# EAGLE design Schematic_v2 (EAGLE 5.10)
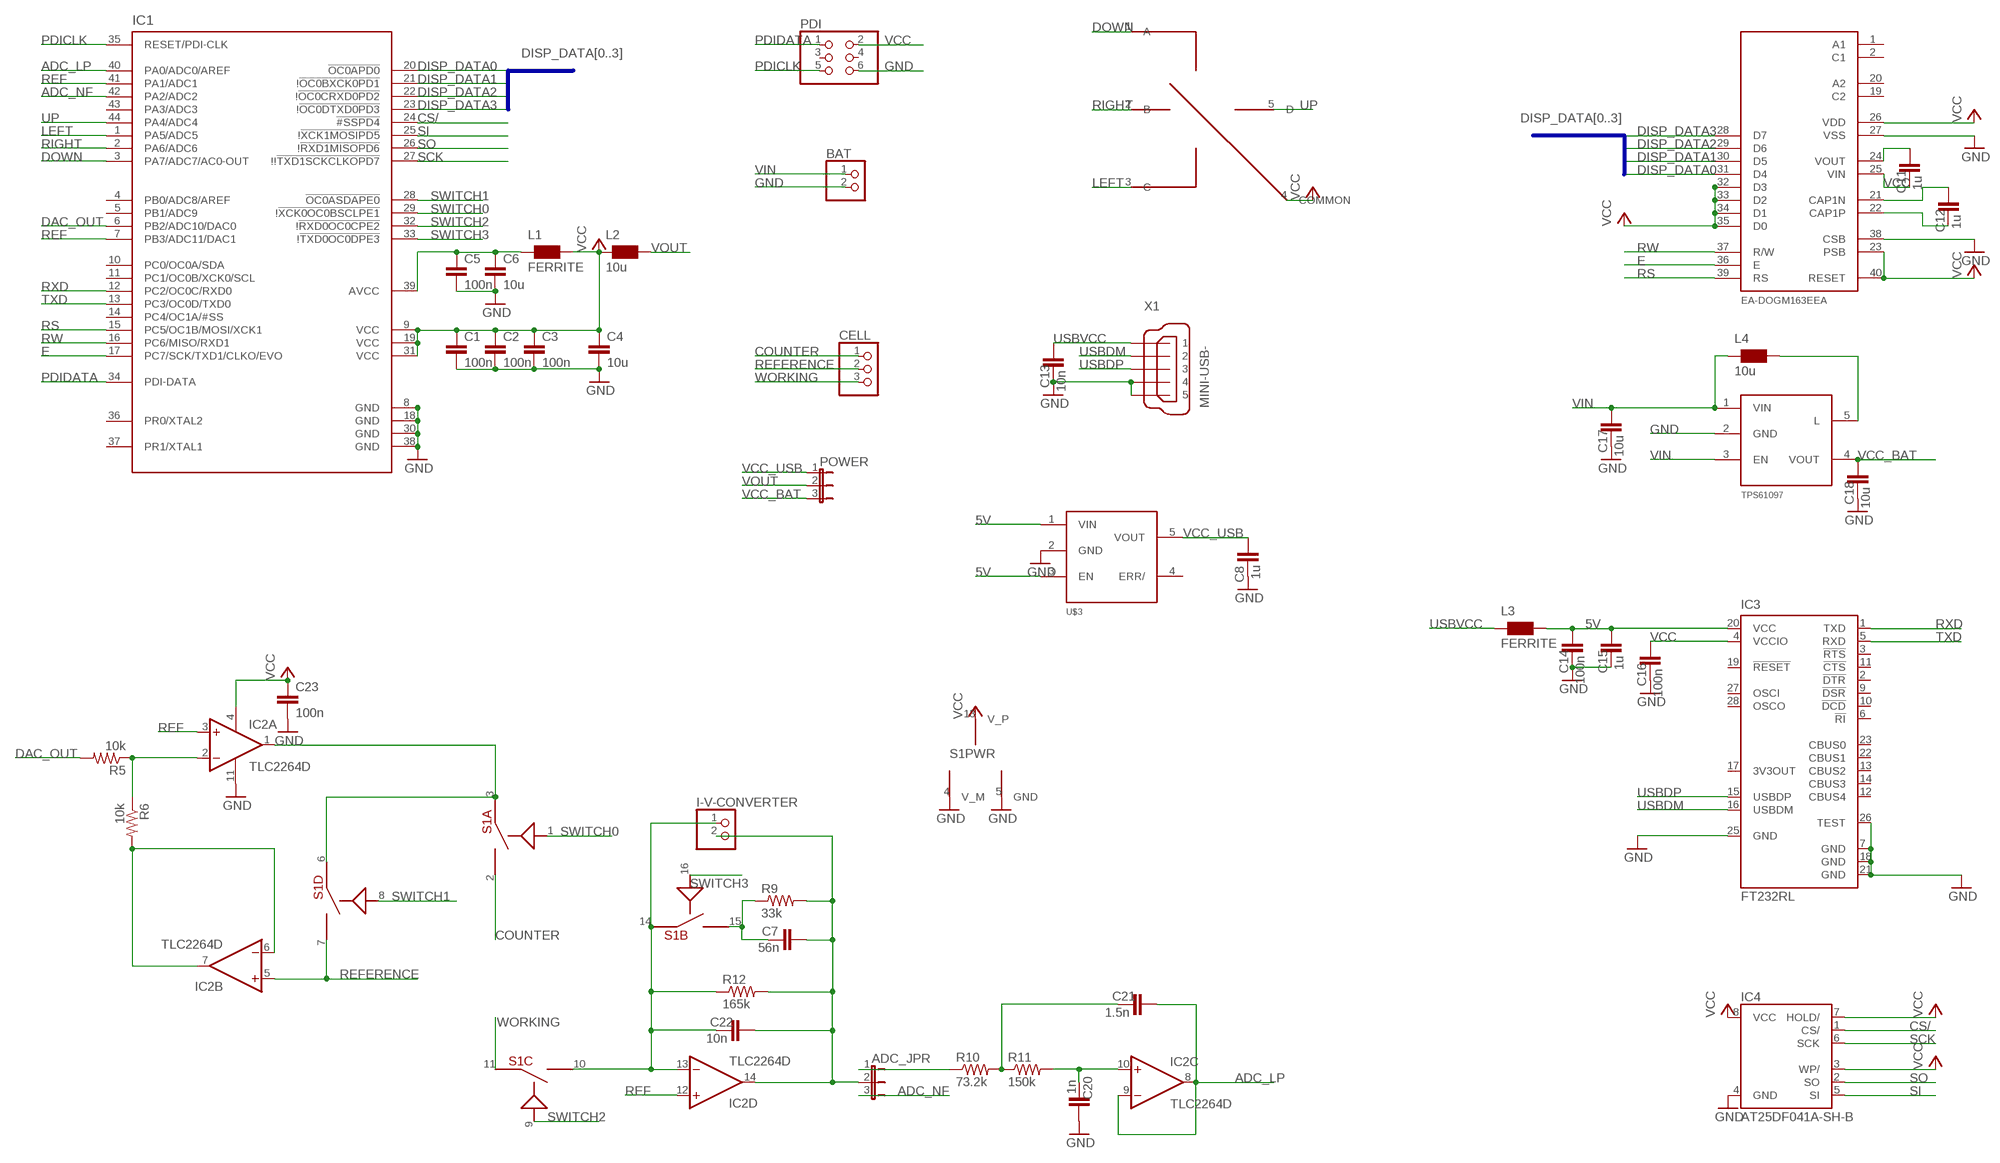
[diagram p0: schematic, sheet 1]

## Parts
ADC_JPR  JP2E  [JP2]
BAT  PINHD-1X2  [1X02]
C1  100n  C-EUC0805  [C0805]
C2  100n  C-EUC0805  [C0805]
C3  100n  C-EUC0805  [C0805]
C4  10u  C-EUC0805  [C0805]
C5  100n  C-EUC0805  [C0805]
C6  10u  C-EUC0805  [C0805]
C7  56n  C-EUC0805  [C0805]
C8  1u  C-EUC0805  [C0805]
C11  1u  C-EUC0805  [C0805]
C12  1u  C-EUC0805  [C0805]
C13  10n  C-EUC0805  [C0805]
C14  100n  C-EUC0805  [C0805]
C15  1u  C-EUC0805  [C0805]
C16  100n  C-EUC0805  [C0805]
C17  10u  C-EUC0805  [C0805]
C18  10u  C-EUC0805  [C0805]
C20  1n  C-EUC0805  [C0805]
C21  1.5n  C-EUC0805  [C0805]
C22  10n  C-EUC0805  [C0805]
C23  100n  C-EUC0805  [C0805]
CELL  PINHD-1X3  [1X03]
I-V-CONVERTER  PINHD-1X2  [1X02]
IC1  AT-XMEGA-XXA4-AU  [QFP80P1200X1200X120-44N]
IC2  TLC2264D  [SO14]
IC3  FT232RL  [SSOP28]
IC4  AT25DF041A-SH-B  [SOIC8]
L1  FERRITE  WE-KIHQ_0805  [WE-KI_0805_B]
L2  10u  WE-KIHQ_0805  [WE-KI_0805_B]
L3  FERRITE  WE-KIHQ_0805  [WE-KI_0805_B]
L4  10u  WE-KIHQ_0805  [WE-KI_0805_B]
PDI  PINHD-2X3  [2X03]
POWER  JP2E  [JP2]
R5  10k  R-US_R0805  [R0805]
R6  10k  R-US_R0805  [R0805]
R9  33k  R-US_R0805  [R0805]
R10  73.2k  R-US_R0805  [R0805]
R11  150k  R-US_R0805  [R0805]
R12  165k  R-US_R0805  [R0805]
S1  DG612  [SOIC16]
TPS61097  DC-DCCONVERTER  [SOT23-5]
U$1  EA_DOG-M_DISPLAY  [E_DOG-M_DISPLAY]
U$2  4DIRSWITCH  [4DIRSWITCH]
U$3  FAN2501  [SOT23-5]
X1  MINI-USB-  [USB-CUSTOM]

## Nets
5V: C14.1 C15.1 IC3.20(VCC) L3.1 U$3.1(VIN) U$3.3(EN)
ADC_LP: C21.1 IC1.40(PA0/ADC0/AREF) IC2.8(C:OUT) IC2.9(C:-IN)
ADC_NF: ADC_JPR.3 IC1.42(PA2/ADC2)
COUNTER: CELL.1 S1.2(A:D)
CS/: IC1.24(!#SSPD4) IC4.1(CS/)
DAC_OUT: IC1.6(PB2/ADC10/DAC0) R5.2
DISP_DATA0: IC1.20(!OC0APD0) U$1.31(D4)
DISP_DATA1: IC1.21(!!OC0BXCK0PD1) U$1.30(D5)
DISP_DATA2: IC1.22(!!OC0CRXD0PD2) U$1.29(D6)
DISP_DATA3: IC1.23(!!OC0DTXD0PD3) U$1.28(D7)
DOWN: IC1.3(PA7/ADC7/AC0-OUT) U$2.1(A)
E: IC1.17(PC7/SCK/TXD1/CLKO/EVO) U$1.36(E)
GND: BAT.2 C1.2 C2.2 C3.2 C4.2 C5.2 C6.2 C8.2 C13.2 C14.2 C15.2 C16.2 C17.2 C18.2 C20.1 C23.2 IC1.8(GND) IC1.18(GND) IC1.30(GND) IC1.38(GND) IC2.11(P:V-) IC3.7(GND) IC3.18(GND) IC3.21(GND) IC3.25(GND) IC3.26(TEST) IC4.4(GND) PDI.6 S1.4(PWR:V_M) S1.5(PWR:GND) TPS61097.2(GND) U$1.27(VSS) U$1.38(CSB) U$3.2(GND) X1.4 X1.5
LEFT: IC1.1(PA5/ADC5) U$2.3(C)
N$3: ADC_JPR.2 C7.1 C22.1 I-V-CONVERTER.2 IC2.14(D:OUT) R9.2 R12.2
N$4: IC2.6(B:-IN) IC2.7(B:OUT) R6.2
N$5: C5.1 C6.1 IC1.39(AVCC) L1.2
N$6: C7.2 R9.1 S1.15(B:D)
N$7: C11.1 U$1.24(VOUT)
N$8: IC2.2(A:-IN) R5.1 R6.1
N$9: C12.1 U$1.21(CAP1N)
N$10: L4.1 TPS61097.5(L)
N$12: C22.2 I-V-CONVERTER.1 IC2.13(D:-IN) R12.1 S1.10(C:D) S1.14(B:S)
N$14: C12.2 U$1.22(CAP1P)
N$16: ADC_JPR.1 R10.1
N$17: C20.2 IC2.10(C:+IN) R11.2
N$19: IC2.1(A:OUT) S1.3(A:S) S1.6(D:S)
N$20: C21.2 R10.2 R11.1
PDICLK: IC1.35(RESET/PDI-CLK) PDI.5
PDIDATA: IC1.34(PDI-DATA) PDI.1
REF: IC1.7(PB3/ADC11/DAC1) IC1.41(PA1/ADC1) IC2.3(A:+IN) IC2.12(D:+IN)
REFERENCE: CELL.2 IC2.5(B:+IN) S1.7(D:D)
RIGHT: IC1.2(PA6/ADC6) U$2.2(B)
RS: IC1.15(PC5/OC1B/MOSI/XCK1) U$1.39(RS)
RW: IC1.16(PC6/MISO/RXD1) U$1.37(R/W)
RXD: IC1.12(PC2/OC0C/RXD0) IC3.1(TXD)
SCK: IC1.27(!!!TXD1SCKCLKOPD7) IC4.6(SCK)
SI: IC1.25(!!XCK1MOSIPD5) IC4.5(SI)
SO: IC1.26(!!RXD1MISOPD6) IC4.2(SO)
SWITCH0: IC1.29(!!XCK0OC0BSCLPE1) S1.1(A:IN)
SWITCH1: IC1.28(!OC0ASDAPE0) S1.8(D:IN)
SWITCH2: IC1.32(!!RXD0OC0CPE2) S1.9(C:IN)
SWITCH3: IC1.33(!!TXD0OC0DPE3) S1.16(B:IN)
TXD: IC1.13(PC3/OC0D/TXD0) IC3.5(RXD)
UP: IC1.44(PA4/ADC4) U$2.5(D)
USBDM: IC3.16(USBDM) X1.2
USBDP: IC3.15(USBDP) X1.3
USBVCC: C13.1 L3.2 X1.1
VCC: C1.1 C2.1 C3.1 C4.1 C11.2 C16.1 C23.1 IC1.9(VCC) IC1.19(VCC) IC1.31(VCC) IC2.4(P:V+) IC3.4(VCCIO) IC4.3(WP/) IC4.7(HOLD/) IC4.8(VCC) L1.1 L2.2 PDI.2 S1.13(PWR:V_P) U$1.23(PSB) U$1.25(VIN) U$1.26(VDD) U$1.32(D3) U$1.33(D2) U$1.34(D1) U$1.35(D0) U$1.40(RESET) U$2.4(COMMON)
VCC_BAT: C18.1 POWER.3 TPS61097.4(VOUT)
VCC_USB: C8.1 POWER.1 U$3.5(VOUT)
VIN: BAT.1 C17.1 L4.2 TPS61097.1(VIN) TPS61097.3(EN)
VOUT: L2.1 POWER.2
WORKING: CELL.3 S1.11(C:S)
Unconnected: IC1.4(PB0/ADC8/AREF) IC1.5(PB1/ADC9) IC1.10(PC0/OC0A/SDA) IC1.11(PC1/OC0B/XCK0/SCL) IC1.14(PC4/OC1A/#SS) IC1.36(PR0/XTAL2) IC1.37(PR1/XTAL1) IC1.43(PA3/ADC3) IC3.2(!DTR) IC3.3(!RTS) IC3.6(!RI) IC3.9(!DSR) IC3.10(!DCD) IC3.11(!CTS) IC3.12(CBUS4) IC3.13(CBUS2) IC3.14(CBUS3) IC3.17(3V3OUT) IC3.19(!RESET) IC3.22(CBUS1) IC3.23(CBUS0) IC3.27(OSCI) IC3.28(OSCO) PDI.3 PDI.4 U$1.1(A1) U$1.2(C1) U$1.19(C2) U$1.20(A2) U$3.4(ERR/)

## Buses
DISP_DATA[0..3]

## Library data of the parts
ADC_JPR POWER = jumper:JP2E: JUMPER
BAT I-V-CONVERTER = pinhead:PINHD-1X2: PIN HEADER
C1-C8 C11-C18 C20-C23 = rcl:C-EU: CAPACITOR, European symbol
CELL = pinhead:PINHD-1X3: PIN HEADER
IC1 = xmega-a4:AT-XMEGA-XXA4-AU: ATxMega a4 Serie
IC2 = linear_new:TLC2264: OP AMP
IC3 = ftdichip:FT232R: Source: http://www.ftdichip.com/Documents/DataSheets/DS_FT232R_v104.pdf
IC4 = atmel:AT25*: SPI bus serial EEPROM
L1-L4 = wuerth-elektronik:WE-KIHQ: SMD Wire Wound Ceramic Inductor WE-KIHQ - High current - Highest Quality factor in size 0805 - up to 98 - High thermal stability - High SRF -- Bluetooth -- Wireless LAN -- RF oscillation circuit -- IF impedance matching -- IG choke
PDI = pinhead:PINHD-2X3: PIN HEADER
R5 R6 R9-R12 = rcl:R-US_: RESISTOR, American symbol
S1 = ECE188:DG612
TPS61097 = analog-devices (2):DC-DCCONVERTER
U$1 = display_ea_dog-m:EA_DOG-M_DISPLAY
U$2 = ECE188:4DIRSWITCH
U$3 = analog-devices (2):FAN2501
X1 = con-cypressindustries:MINI-USB-: MINI USB-B Conector Source: www.cypressindustries.com

## Board
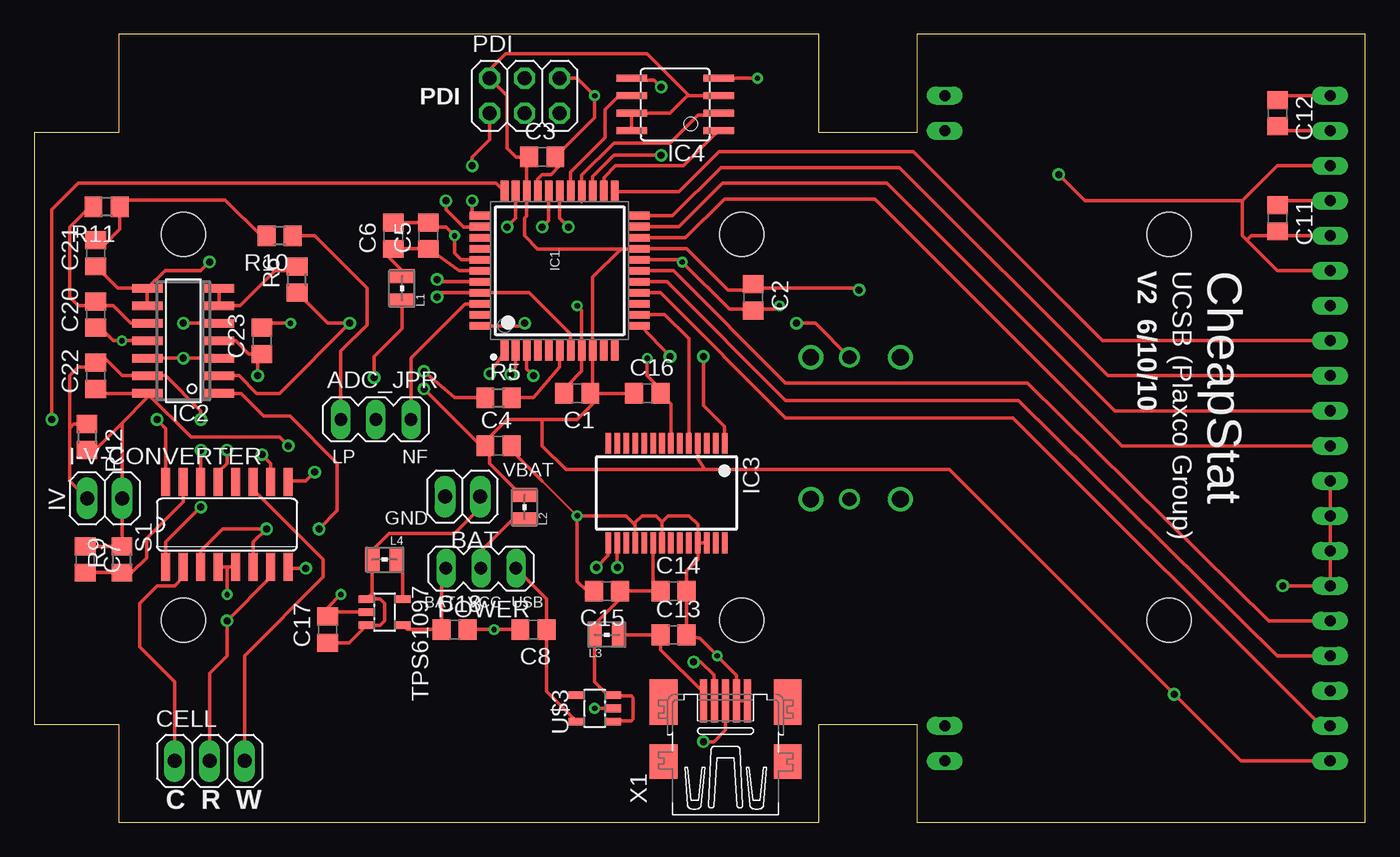
[diagram p1: board, top side]
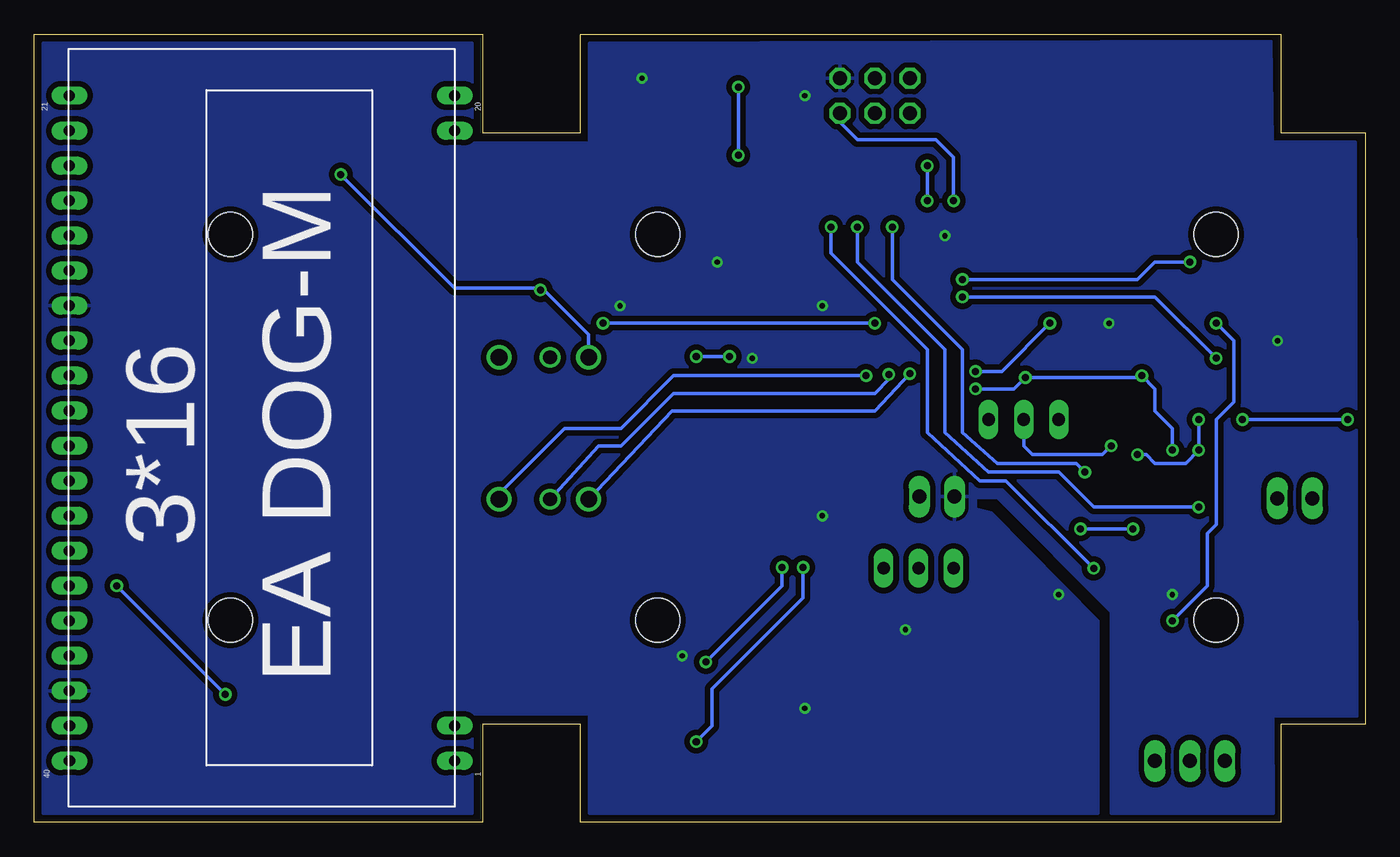
[diagram p2: board, bottom side, seen from below]

Size 96.52 x 57.15 mm. Coordinates in mm from the lower left corner, seen from the top.
Outline: 6.1,0 56.9,0 56.9,7.11 64.01,7.11 64.01,0 96.52,0 96.52,57.15 64.01,57.15 64.01,50.04 56.9,50.04 56.9,57.15 6.1,57.15 6.1,50.04 0,50.04 0,7.11 6.1,7.11 6.1,0
Copper layers (1*16): Top 0.035mm / dielectric 1.5mm / Bottom 0.035mm
Design rules "default *": minimum track width 7mil, minimum drill 15mil, track to track 7mil, track to pad 7mil, pad to pad 7mil, via to via 7mil, smd to smd 7mil, copper to edge 10mil, drill to drill 8mil, minimum pad ring 10mil, minimum via ring 8mil, stop-mask expansion 4mil, vias tented up to drill 0mil, thermal gap 10mil
Holes 3.2 mm at 10.79,14.64 82.3,42.64 82.3,14.64 10.79,42.64 51.3,42.64 51.3,14.64

### Footprints (pad centres in the part's own frame; a part is rotated, then mirrored left to right if it is on the bottom)
JP2 = drill 0.914 long: 1 -2.54,0; 2 0,0; 3 2.54,0
1X02 = drill 1.016 long: 1 -1.27,0; 2 1.27,0
C0805 = smd 1.3 x 1.5: 1 -0.95,0; 2 0.95,0
1X03 = drill 1.016 long: 1 -2.54,0; 2 0,0; 3 2.54,0
QFP80P1200X1200X120-44N = smd 1.55 x 0.55: 1 -5.75,4; 2 -5.75,3.2; 3 -5.75,2.4; 4 -5.75,1.6; 5 -5.75,0.8; 6 -5.75,0; 7 -5.75,-0.8; 8 -5.75,-1.6; 9 -5.75,-2.4; 10 -5.75,-3.2; 11 -5.75,-4; 23 5.75,-4; 24 5.75,-3.2; 25 5.75,-2.4; 26 5.75,-1.6; 27 5.75,-0.8; 28 5.75,0; 29 5.75,0.8; 30 5.75,1.6; 31 5.75,2.4; 32 5.75,3.2; 33 5.75,4 | smd 0.55 x 1.55: 12 -4,-5.75; 13 -3.2,-5.75; 14 -2.4,-5.75; 15 -1.6,-5.75; 16 -0.8,-5.75; 17 0,-5.75; 18 0.8,-5.75; 19 1.6,-5.75; 20 2.4,-5.75; 21 3.2,-5.75; 22 4,-5.75; 34 4,5.75; 35 3.2,5.75; 36 2.4,5.75; 37 1.6,5.75; 38 0.8,5.75; 39 0,5.75; 40 -0.8,5.75; 41 -1.6,5.75; 42 -2.4,5.75; 43 -3.2,5.75; 44 -4,5.75
SO14 = smd 0.6 x 2.2: 1 -3.81,-2.6; 2 -2.54,-2.6; 3 -1.27,-2.6; 4 0,-2.6; 5 1.27,-2.6; 6 2.54,-2.6; 7 3.81,-2.6; 8 3.81,2.6; 9 2.54,2.6; 10 1.27,2.6; 11 0,2.6; 12 -1.27,2.6; 13 -2.54,2.6; 14 -3.81,2.6
SSOP28 = smd 0.4 x 1.5: 1 -4.225,-3.625; 2 -3.575,-3.625; 3 -2.925,-3.625; 4 -2.275,-3.625; 5 -1.625,-3.625; 6 -0.975,-3.625; 7 -0.325,-3.625; 8 0.325,-3.625; 9 0.975,-3.625; 10 1.625,-3.625; 11 2.275,-3.625; 12 2.925,-3.625; 13 3.575,-3.625; 14 4.225,-3.625; 15 4.225,3.625; 16 3.575,3.625; 17 2.925,3.625; 18 2.275,3.625; 19 1.625,3.625; 20 0.975,3.625; 21 0.325,3.625; 22 -0.325,3.625; 23 -0.975,3.625; 24 -1.625,3.625; 25 -2.275,3.625; 26 -2.925,3.625; 27 -3.575,3.625; 28 -4.225,3.625
SOIC8 = smd 0.5 x 2.2: 1 -1.905,-3.154; 2 -0.645,-3.154; 3 0.625,-3.154; 4 1.895,-3.154; 5 1.905,3.154; 6 0.635,3.154; 7 -0.635,3.154; 8 -1.905,3.154
WE-KI_0805_B = smd 1.02 x 1.78: 1 -0.89,0; 2 0.89,0
2X03 = drill 1.016 octagon: 1 -2.54,-1.27; 2 -2.54,1.27; 3 0,-1.27; 4 0,1.27; 5 2.54,-1.27; 6 2.54,1.27
R0805 = smd 1.3 x 1.5: 1 -0.95,0; 2 0.95,0
SOIC16 = smd 0.66 x 2.032: 1 -4.445,-3.073; 2 -3.175,-3.073; 3 -1.905,-3.073; 4 -0.635,-3.073; 5 0.635,-3.073; 6 1.905,-3.073; 7 3.175,-3.073; 8 4.445,-3.073; 9 4.445,3.073; 10 3.175,3.073; 11 1.905,3.073; 12 0.635,3.073; 13 -0.635,3.073; 14 -1.905,3.073; 15 -3.175,3.073; 16 -4.445,3.073
SOT23-5 = smd 0.55 x 1.2: 1 -0.95,-1.3; 2 0,-1.3; 3 0.95,-1.3; 4 0.95,1.3; 5 -0.95,1.3
E_DOG-M_DISPLAY = drill 0.8 long: 1 3.334,0; 2 5.874,0; 19 49.054,0; 20 51.594,0; 21 51.594,27.94; 22 49.054,27.94; 23 46.514,27.94; 24 43.974,27.94; 25 41.434,27.94; 26 38.894,27.94; 27 36.354,27.94; 28 33.814,27.94; 29 31.274,27.94; 30 28.734,27.94; 31 26.194,27.94; 32 23.654,27.94; 33 21.114,27.94; 34 18.574,27.94; 35 16.034,27.94; 36 13.494,27.94; 37 10.954,27.94; 38 8.414,27.94; 39 5.874,27.94; 40 3.334,27.94
4DIRSWITCH = drill 1.2 round: 1 -5.15,6.05; 3 -5.15,-0.45; 4 5.15,-0.45; 6 5.15,6.05 | drill 1 round: 2 -5.15,2.35; 5 5.15,2.35
USB-CUSTOM = smd 3.1 x 0.5: 1 5.5,4.3; 2 5.5,3.5; 3 5.5,2.7; 4 5.5,1.9; 5 5.5,1.1 | smd 2.5 x 2: M1 1.1,-1.8; M2 1.1,7.2 | smd 3.3 x 2: M3 5.4,7.2; M4 5.4,-1.8

### Placement (x,y rotation side)
ADC_JPR  24.77,29.21 0 top
BAT  31.05,23.61 180 top
C1  39.37,31.11 180 top
C2  52.15,38.07 270 top
C3  36.83,48.26 0 top
C4  33.66,27.3 0 top
C5  28.57,42.55 90 top
C6  26.04,42.55 90 top
C7  3.68,19.05 270 top
C8  36.2,13.97 180 top
C11  90.17,43.81 270 top
C12  90.17,51.44 270 top
C13  46.35,13.59 0 top
C14  46.35,16.76 0 top
C15  41.53,16.76 180 top
C16  44.45,31.11 0 top
C17  21.27,13.97 90 top
C18  30.48,13.97 0 top
C20  4.45,36.83 90 top
C21  4.45,41.27 90 top
C22  4.45,32.38 90 top
C23  16.51,34.92 90 top
CELL  12.7,4.45 0 top
I-V-CONVERTER  5.08,23.5 0 top
IC1  38.1,40.01 90 top
IC2  10.79,34.92 90 top
IC3  45.85,23.88 180 top
IC4  46.48,52.07 90 top
L1  26.67,38.73 90 top
L2  35.56,22.86 90 top
L3  41.53,13.59 0 top
L4  25.4,19.05 180 top
PDI  35.56,52.7 0 top
POWER  32.38,18.41 180 top
R5  33.66,30.8 0 top
R6  19.05,39.37 90 top
R9  6.35,19.05 90 top
R10  17.78,42.55 180 top
R11  5.23,44.63 180 top
R12  3.81,27.94 270 top
S1  13.97,21.59 0 top
TPS61097  25.4,15.24 270 top
U$1  66.04,1.11 90 bottom
U$2  56.77,28.57 90 bottom
U$3  40.64,8.26 90 top
X1  52.83,3.3 90 top

### Tracks (layer width: path | path; a pad name or v marks a point on that pad's centre or on a via)
5V
  Top 0.254: U$3.1 42.04,7.37 43.31,7.37 43.43,7.49 43.43,9.02 43.31,9.14 42.04,9.14 U$3.3 41.59,9.21 40.64,10.16 L3.1 40.51,13.71 40.51,14.22 42.48,16.19 C15.1 C14.1 44.87,17.3 IC3.20
ADC_LP  (via drill 0.51)
  Top 0.254: IC2.8 6.04,38.73 C21.1 | IC2.8 IC2.9 | v12.7,40.64 12.06,40.01 9.46,40.01 IC2.8 | IC1.40 29.38,39.2 v29.21,39.37
  Bottom 0.254: v29.21,39.37 16.51,39.37 15.24,40.64 v12.7,40.64
ADC_NF
  Top 0.254: IC1.42 31.25,37.6 27.3,33.66 ADC_JPR.3
COUNTER
  Top 0.254: S1.2 10.79,17.78 10.16,17.14 8.89,17.14 7.62,15.88 7.62,12.7 10.16,10.16 CELL.1
CS/
  Top 0.254: IC1.24 41.3,46.76 42.16,47.62 47.1,47.62 IC4.1
DAC_OUT
  Top 0.254: IC1.6 38.1,33.02 36.2,30.8 R5.2
DISP_DATA0
  Top 0.254: IC1.20 47.23,42.41 50.04,45.21 60.96,45.21 78.87,27.3 U$1.31
DISP_DATA1
  Top 0.254: IC1.21 46.76,43.2 49.91,46.35 61.85,46.35 78.36,29.84 U$1.30
DISP_DATA2
  Top 0.254: IC1.22 46.29,44.01 49.78,47.5 62.74,47.5 77.85,32.38 U$1.29
DISP_DATA3
  Top 0.254: IC1.23 46.77,45.76 49.66,48.64 63.75,48.64 77.47,34.92 U$1.28
DOWN  (via drill 0.51)
  Top 0.254: IC1.3 35.7,32.88 v36.2,32.38
  Bottom 0.254: v36.2,32.38 50.16,32.38 53.98,28.57 58.05,28.57 62.82,23.81 U$2.1
E
  Top 0.254: U$1.36 89.54,14.61 89.53,14.61 72.01,31.88 54.48,31.88 46.35,40.01 IC1.17
GND  (via drill 0.38)
  Top 0.178: v39.37,22.23 36.83,24.77 | 34.29,27.3 C4.2 | C23.2 16.51,36.2 | C16.2 45.72,31.11
  Top 0.254: IC2.11 v6.35,34.92 5.71,34.92 5.08,35.56 4.76,35.56 C20.1 | IC1.18 46.83,40.8 v46.99,40.64 50.42,37.21 51.3,37.21 C2.2 51.98,37.21 53.72,37.21 53.98,37.47 | C1.2 38.73,31.43 38.73,31.75 39.7,32.72 IC1.8 39.7,37.13 v39.37,37.47 | IC3.25 IC3.26 | PDI.6 39.37,53.98 v40.64,52.7 40.64,51.12 C3.2 38.1,47.94 38.1,47.62 37.47,46.99 36.83,46.99 36.5,46.66 IC1.30 | IC1.38 30.95,40.8 30.48,41.27 v30.48,42.55 29.84,43.18 28.89,43.18 C5.2 C6.2 | 36.83,24.77 34.29,27.3 | 16.51,36.2 v18.57,36.2 | 45.72,31.11 44.45,32.38 v44.45,33.66 | 45.09,30.48 45.09,30.8 C16.2 46.17,30.34 IC3.7 | 13.97,18.52 S1.5 | 13.97,18.52 S1.4 | v13.97,16.51 13.97,18.52 | X1.5 X1.4 50.93,10.66 48.26,13.34 C13.2 C14.2 47.3,18.22 48.13,19.05 48.13,20.24 IC3.25 | IC3.25 48.12,21.6 47.5,22.23 45.97,22.23 45.52,21.77 | 45.52,21.77 IC3.21 | 45.52,21.77 45.07,22.23 44.07,22.23 43.57,21.73 IC3.18 43.57,21.58 42.93,22.23 v39.37,22.23 39.37,17.46 40.07,16.76 C15.2 | IC4.4 52.44,53.97 v52.45,53.98 | TPS61097.2 21.59,15.24 C17.2 21.27,15.56 v22.23,16.51 | U$3.2 v40.64,8.26 | C18.2 v33.34,13.97 C8.2
  other vias: 54.04,37.47 49.53,12.06
  pour Bottom (isolate 0.406): 95.89,56.52 95.89,0.64 64.77,0.64 64.77,7.87 56.26,7.87 56.26,0.64 19.37,0.64 19.37,14.61 27.11,22.42 28.26,22.73 28.26,23.56 26.67,23.56 18.41,15.24 18.41,0.64 6.67,0.64 6.69,7.7 0.61,7.67 0.71,49.33 6.74,49.33 6.82,56.64 56.26,56.52 56.26,49.28 64.77,49.28 64.77,56.52
LEFT  (via drill 0.51)
  Top 0.254: IC1.1 34.1,34.1 v33.02,32.54
  Bottom 0.254: U$2.3 50.28,29.84 35.56,29.84 v33.02,32.54
N$3  (via drill 0.51)
  Top 0.254: IC2.14 4.76,31.11 C22.1 | IC2.14 11.37,27.94 17.78,27.94 v18.41,27.3 | C7.1 R9.2 I-V-CONVERTER.2 6.35,28.96 | IC2.14 8.2,30.8 6.35,28.96 | 6.35,28.96 4.57,27.18 4,27.18 R12.2
  Bottom 0.254: ADC_JPR.2 24.77,27.3 24.13,26.67 19.05,26.67 v18.41,27.3
N$4
  Top 0.254: IC2.7 IC2.6 14.92,37.47 17.46,40.01 18.73,40.01 R6.2
N$5
  Top 0.254: IC1.39 30.8,40.01 C5.1 C6.1 25.71,41.27 25.4,41.27 26.67,40.01 L1.2
N$6
  Top 0.254: C7.2 R9.1 7.05,18.1 8.13,19.18 8.13,20.57 10.79,23.24 S1.15
N$7
  Top 0.254: U$1.24 90.49,45.09 C11.1
N$8  (via drill 0.51)
  Top 0.254: R5.1 30.48,30.8 v28.26,32.7 | IC2.2 14.86,32.38 16.13,31.11 17.78,31.11 v22.86,36.2 21.27,36.2 R6.1
  Bottom 0.254: v28.26,32.7 26.35,32.7 v22.86,36.2
N$9
  Top 0.254: U$1.21 90.49,52.71 C12.1
N$10
  Top 0.254: TPS61097.5 26.7,18.64 L4.1
N$12  (via drill 0.51)
  Top 0.254: C22.2 4.76,33.66 5.08,33.66 6.35,32.38 IC2.13 9.53,32.38 12.06,29.84 v12.06,29.21 | 3.81,33.66 4.12,33.66 C22.2 | R12.1 2.85,28.89 2.54,28.57 | 2.54,28.57 2.54,24.77 I-V-CONVERTER.1 | 3.81,33.66 3.81,33.02 3.17,33.02 2.54,32.38 2.54,28.57 | 3.81,33.66 C22.2 | v12.06,26.99 S1.14 | S1.10 17.14,26.04 v16.51,26.67
  Bottom 0.254: v12.06,29.21 v12.06,26.99 13.02,26.04 15.24,26.04 15.88,26.67 v16.51,26.67
N$14
  Top 0.254: U$1.22 90.49,50.17 C12.2
N$16
  Top 0.254: R10.1 20.32,42.55 24.13,38.73 24.13,36.07 22.23,34.16 ADC_JPR.1
N$17
  Top 0.254: IC2.10 6.99,36.2 5.71,37.47 4.76,37.47 C20.2 4.45,37.47 3.17,37.47 2.54,38.1 2.54,43.18 3.81,44.45 R11.2
N$19  (via drill 0.51)
  Top 0.254: v20.64,21.27 21.97,22.61 21.97,26.04 18.54,29.46 16.64,29.46 14.99,31.11 IC2.1 | S1.6 15.88,20.32 v16.83,21.27 13.65,21.27 12.06,19.68 S1.3
  Bottom 0.254: v16.83,21.27 v20.64,21.27
N$20
  Top 0.254: 16.51,42.55 R10.2 16.43,42.55 13.84,45.14 6.68,45.14 R11.1 6.18,43.01 5.08,41.91 4.76,41.91 C21.2
PDICLK  (via drill 0.51)
  Top 0.254: IC1.35 31.75,43.18 31.11,43.18 29.84,44.45 v29.84,45.09
  Bottom 0.254: PDI.5 38.1,50.8 36.83,49.53 31.11,49.53 29.84,48.26 v29.84,45.09
PDIDATA  (via drill 0.51)
  Top 0.254: v31.75,47.62 31.75,48.26 33.02,49.53 PDI.1 | v31.75,45.09 31.75,43.81 IC1.34
  Bottom 0.254: v31.75,45.09 v31.75,47.62
REF  (via drill 0.51)
  Top 0.254: IC2.12 v10.79,33.66 IC2.3 | v29.21,38.1 29.52,38.41 IC1.41 32.36,38.42 35.88,38.42 38.9,35.4 IC1.7
  Bottom 0.254: v29.21,38.1 15.24,38.1 v10.79,33.66
REFERENCE  (via drill 0.51)
  Top 0.254: S1.7 17.14,17.78 v13.97,14.61 13.97,12.06 12.7,10.79 CELL.2 | v10.79,36.2 IC2.5
  Bottom 0.254: v10.79,36.2 9.53,34.92 9.53,30.48 10.79,29.21 10.79,21.59 11.43,20.95 11.43,17.14 v13.97,14.61
RIGHT  (via drill 0.51)
  Top 0.254: IC1.2 34.9,32.99 v34.54,32.48
  Bottom 0.254: v34.54,32.48 34.54,32.13 35.56,31.11 50.16,31.11 53.98,27.3 55.62,27.3 U$2.2
RS
  Top 0.254: U$1.39 93.34,6.99 70.99,29.34 54.48,29.34 45.41,38.41 IC1.15
RW
  Top 0.254: IC1.16 45.88,39.2 54.48,30.61 71.37,30.61 90.17,12.06 U$1.37
RXD  (via drill 0.51)
  Top 0.254: IC1.12 44.01,36.01 v46.1,33.78 | v48.51,33.78 48.51,30.23 50.04,28.7 50.04,27.54 IC3.1
  Bottom 0.254: v48.51,33.78 v46.1,33.78
SCK
  Top 0.254: IC1.27 38.9,47.16 41.4,49.66 41.4,51.69 42.42,52.7 IC4.6
SI  (via drill 0.51)
  Top 0.254: IC1.25 40.5,46.85 42.04,48.39 v45.47,48.39 | v45.47,53.34 44.96,53.85 43.45,53.85 IC4.5
  Bottom 0.254: v45.47,48.39 v45.47,53.34
SO
  Top 0.254: 39.7,45.01 IC1.26 39.7,46.94 42.04,49.28 46.1,49.28 48.13,51.31 49.52,51.31 IC4.2
SWITCH0  (via drill 0.51)
  Top 0.254: IC1.29 37.3,43.65 v36.83,43.18 | v12.06,22.86 9.53,20.32 S1.1
  Bottom 0.254: v12.06,22.86 19.68,22.86 22.23,25.4 27.3,25.4 30.48,28.26 30.48,34.29 36.83,40.64 v36.83,43.18
SWITCH1  (via drill 0.51)
  Top 0.254: IC1.28 38.1,43.81 v38.73,43.18 | S1.8 18.41,18.41 v19.68,18.41
  Bottom 0.254: v38.73,43.18 38.73,41.27 31.75,34.29 31.75,28.26 27.94,24.77 26.04,24.77 v19.68,18.41
SWITCH2  (via drill 0.51)
  Top 0.254: IC1.32 34.9,43.84 v34.29,43.18 | v20.32,25.4 19.68,24.77 18.41,24.77 S1.9
  Bottom 0.254: v34.29,43.18 34.29,39.37 29.21,34.29 29.21,28.26 26.67,26.04 20.95,26.04 v20.32,25.4
SWITCH3  (via drill 0.51)
  Top 0.254: v8.89,29.21 9.53,28.57 S1.16 | v1.27,29.21 1.27,44.45 3.17,46.35 33.5,46.35 IC1.33
  Bottom 0.254: v1.27,29.21 v8.89,29.21
TXD
  Top 0.254: IC1.13 43.88,36.83 45.72,36.83 47.47,35.08 IC3.5
UP  (via drill 0.51)
  Top 0.254: v55.28,36.2 56.65,36.2 U$2.5 | IC1.44 35.37,36.01 v35.56,36.2
  Bottom 0.254: v35.56,36.2 v55.28,36.2
USBDM  (via drill 0.51)
  Top 0.254: IC3.16 42.27,18.5 v42.29,18.48 | v47.82,11.62 48.32,11.62 49.28,10.67 49.28,8.86 X1.2
  Bottom 0.254: v42.29,18.48 42.29,17.14 v47.82,11.62
USBDP  (via drill 0.51)
  Top 0.254: IC3.15 41.62,19.33 v40.77,18.48 | X1.3 50.13,6.7 49.28,5.84 v48.51,5.84
  Bottom 0.254: v40.77,18.48 40.77,16.26 47.37,9.65 47.37,6.99 v48.51,5.84
USBVCC
  Top 0.254: L3.2 C13.1 45.41,12.51 48.51,9.4 48.51,8.82 X1.1
VCC  (via drill 0.51)
  Top 0.178: U$1.40
  Top 0.254: U$1.23 90.17,47.63 87.63,45.09 | 87.63,45.09 87.63,42.55 87.95,42.23 | 87.95,42.23 90.17,40.01 U$1.26 | C1.1 40.5,31.3 IC1.9 40.5,39.55 42.55,41.59 | IC2.4 14.61,34.92 15.55,33.98 C23.1 16.19,33.66 v16.19,32.38 | 42.55,41.59 36.51,41.59 35.56,42.55 35.56,43.81 35.7,43.95 IC1.31 35.7,48.08 C3.1 34.92,48.26 34.29,48.9 34.29,52.7 PDI.2 33.02,54.61 34.16,55.75 44.45,55.75 47.5,52.7 | 42.55,41.59 43.84,41.59 IC1.19 47.3,41.6 50.29,38.61 51.55,38.61 C2.1 51.69,38.73 59.82,38.73 v59.82,38.61 | 87.63,45.09 76.2,45.09 v74.3,46.99 | 33.02,26.99 33.02,27.94 34.29,29.21 36.83,29.21 | 36.83,29.21 39.37,29.21 40.64,30.48 40.64,30.8 C1.1 | 36.83,29.21 36.83,27.3 38.54,25.59 48.64,25.59 | v13.97,26.99 13.97,26.04 13.34,25.4 S1.13 | v28.26,31.43 32.06,27.62 32.38,27.62 C4.1 33.02,26.99 | C1.1 C16.1 | C11.2 90.49,42.55 U$1.25 88.27,42.55 87.95,42.23 | U$1.32 U$1.33 U$1.34 U$1.35 v90.55,17.15 v90.55,17.14 | IC4.8 IC4.7 46.1,51.44 47.37,52.7 47.5,52.7 | IC3.4 48.12,26.36 48.64,25.59 | 48.64,25.59 66.36,25.59 v82.68,9.27 87.5,4.45 U$1.40 | IC4.3 49.63,52.7 47.5,52.7 | 24.7,32.19 v24.64,32.26 24.64,33.78 26.67,35.81 L1.1 | L2.2 35.3,23.75 33.02,26.04 33.02,26.99
  Bottom 0.254: v13.97,26.99 13.97,28.57 15.24,29.84 15.24,31.43 v16.19,32.38 16.32,32.26 v24.64,32.26 25.46,31.43 v28.26,31.43 | U$2.4 56.33,35.38 59.63,38.67 | 59.63,38.67 59.69,38.73 66.04,38.73 v74.3,46.99 | v59.82,38.61 59.69,38.61 59.63,38.67 | v82.68,9.27 v90.55,17.14
VCC_BAT
  Top 0.254: TPS61097.4 27.02,13.97 C18.1 29.53,18.1 POWER.3
VCC_USB
  Top 0.254: POWER.1 37.15,16.2 C8.1 37.15,9.5 U$3.5
VIN
  Top 0.254: C17.1 22.83,13.02 TPS61097.3 25.09,14.29 25.4,14.61 25.4,15.88 25.09,16.19 TPS61097.1 24.51,16.6 L4.2 24.45,19.11 24.45,19.68 25.72,20.95 30.48,20.95 32.33,22.8 BAT.1
VOUT
  Top 0.254: L2.1 34.67,21.97 32.38,19.68 POWER.2
WORKING
  Top 0.254: S1.11 15.88,24.13 20.95,19.05 20.95,17.78 15.24,12.06 CELL.3

### Text on the board
tPlace: PDI | V2 | UCSB (Plaxco Group) | CheapStat | 6/10/10 | LP | NF | VBAT | IV | GND | BAT | VCC | USB | C | R | W